# EAGLE design v1.0 (EAGLE 9.6.2)
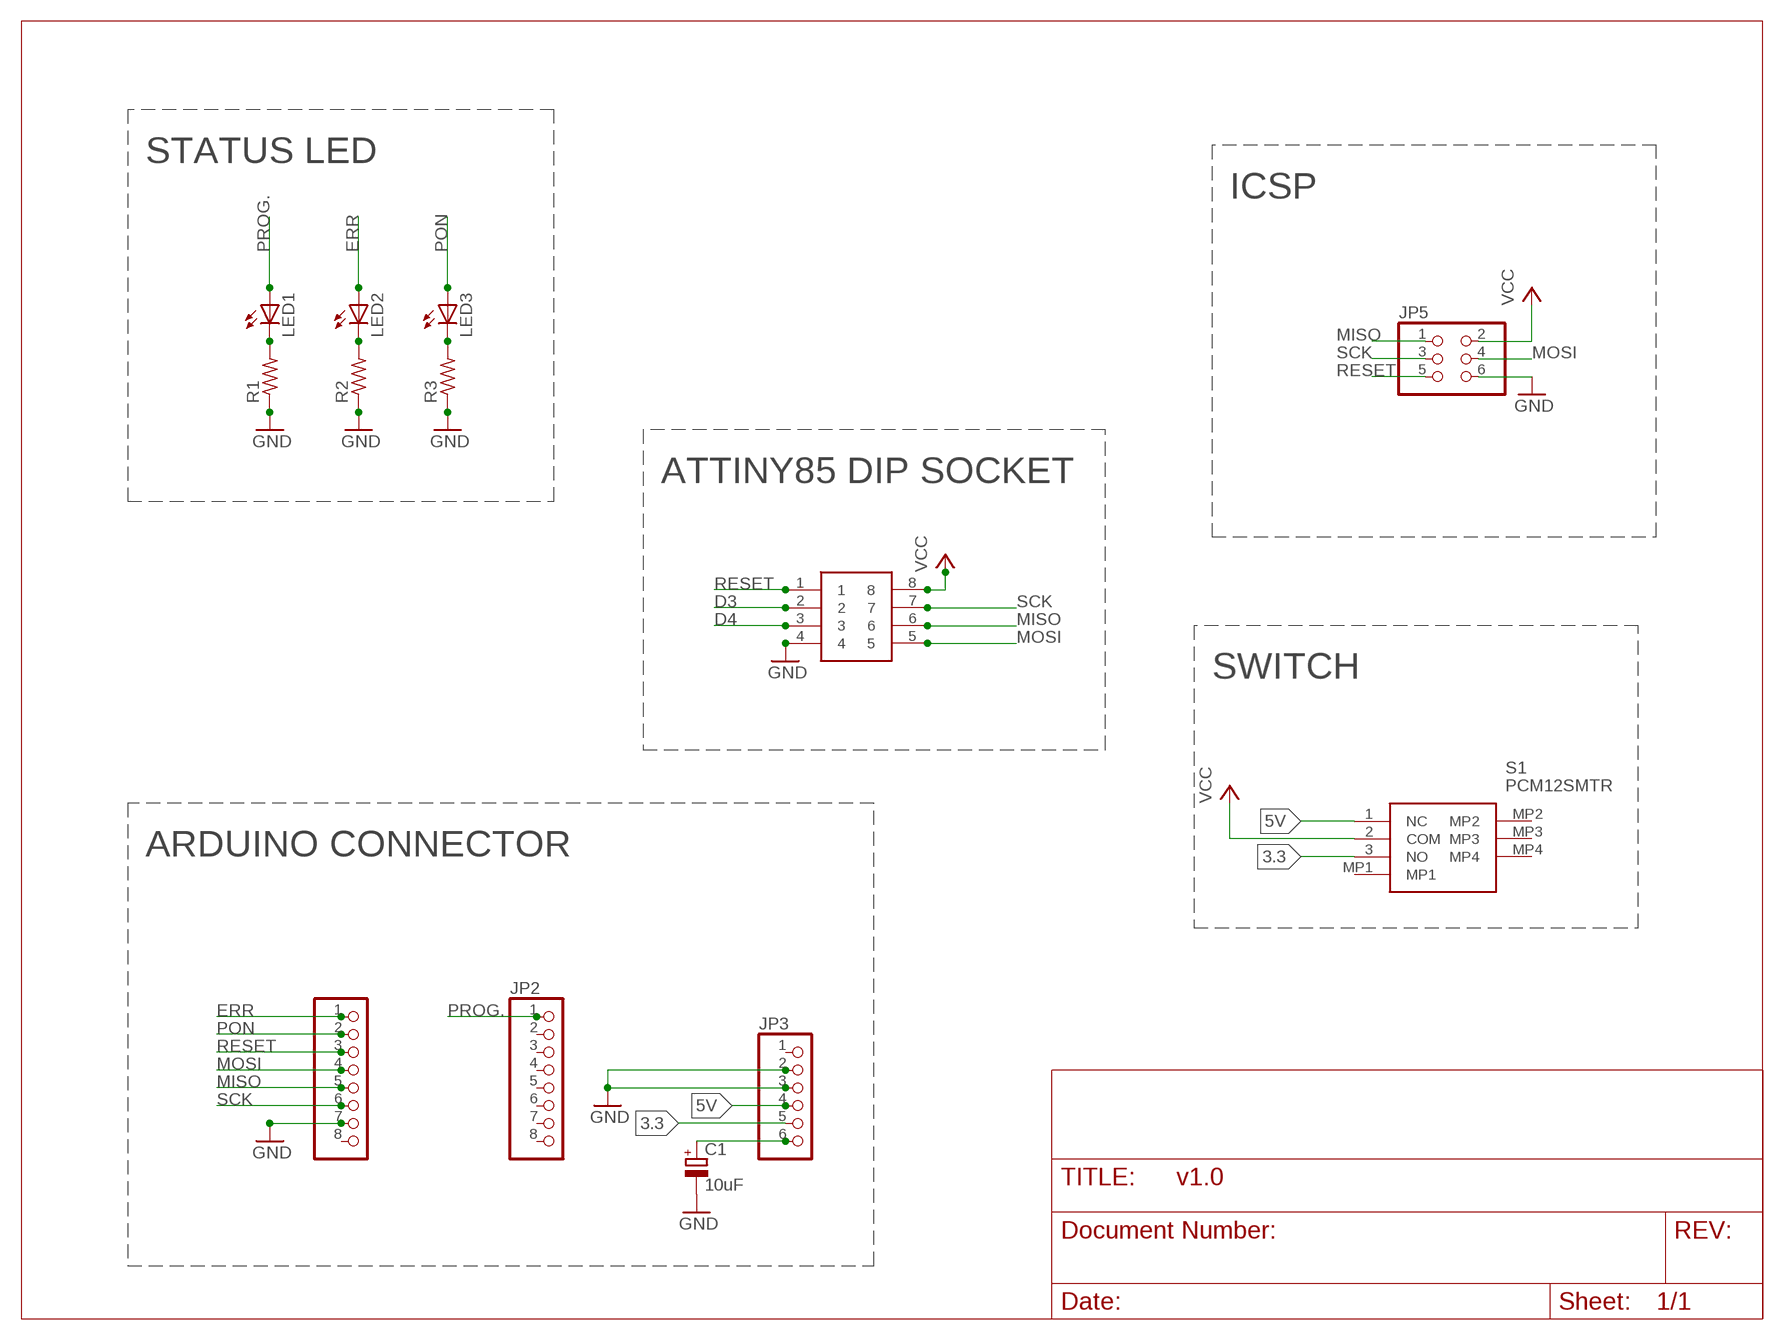
[diagram p0: schematic, sheet 1]

## Parts
C1  10uF  CPOL-EUE2-5  [E2-5]
IC1  1-2199298-2  [DIPS762W70P254L1016H510Q8N]
JP2  PINHD-1X8  [1X08]
JP3  PINHD-1X6  [1X06]
JP4  PINHD-1X8  [1X08]
JP5  PINHD-2X3  [2X03]
LED1  LED3MM  [LED3MM]
LED2  LED3MM  [LED3MM]
LED3  LED3MM  [LED3MM]
R1  R-US_0207/10  [0207/10]
R2  R-US_0207/10  [0207/10]
R3  R-US_0207/10  [0207/10]
S1  PCM12SMTR  [PCM12SMTR]

## Nets
3.3: JP3.5 S1.3(NO)
5V: JP3.4 S1.1(NC)
D3: IC1.2
D4: IC1.3
ERR: JP4.1 LED2.A
GND: C1.- IC1.4 JP3.2 JP3.3 JP4.7 JP5.6 R1.1 R2.1 R3.1
MISO: IC1.6 JP4.5 JP5.1
MOSI: IC1.5 JP4.4 JP5.4
N$1: C1.+ JP3.6
N$2: LED1.K(C) R1.2
N$3: LED2.K(C) R2.2
N$4: LED3.K(C) R3.2
PON: JP4.2 LED3.A
PROG.: JP2.1 LED1.A
RESET: IC1.1 JP4.3 JP5.5
SCK: IC1.7 JP4.6 JP5.3
VCC: IC1.8 JP5.2 S1.2(COM)
Unconnected: JP2.2 JP2.3 JP2.4 JP2.5 JP2.6 JP2.7 JP2.8 JP3.1 JP4.8 S1.MP1 S1.MP2 S1.MP3 S1.MP4

## Notes on the sheet
- STATUS LED
- ICSP
- ATTINY85 DIP SOCKET
- SWITCH
- ARDUINO CONNECTOR

## Library data of the parts
C1 = rcl:CPOL-EU: POLARIZED CAPACITOR, European symbol; SPICEPREFIX: C
IC1 = 1-2199298-2:1-2199298-2: TE CONNECTIVITY - 1-2199298-2 - IC SOCKET, DIP, 8POS, TH Source: Datasheet <https://componentsearchengine.com/Datasheets/2/1-2199298-2.pdf>; DESCRIPTION: TE CONNECTIVITY - 1-2199298-2 - IC SOCKET, DIP, 8POS, TH; HEIGHT: 5.1mm; MANUFACTURER_NAME: TE Connectivity; MANUFACTURER_PART_NUMBER: 1-2199298-2; MOUSER_PART_NUMBER: 571-1-2199298-2; MOUSER_PRICE-STOCK: https://www.mouser.co.uk/ProductDetail/TE-Connectivity/1-2199298-2?qs=fK8dlpkaUMtEKa4wabwOXQ%3D%3D
JP2 JP4 = pinhead:PINHD-1X8: PIN HEADER
JP3 = pinhead:PINHD-1X6: PIN HEADER
JP5 = pinhead:PINHD-2X3: PIN HEADER
LED1-LED3 = adafruit:LED: LED OSRAM: - CHIPLED LG R971, LG N971, LY N971, LG Q971, LY Q971, LO R971, LY R971 LH N974, LH R974 LS Q976, LO Q976, LY Q976 LO Q996 - Hyper CHIPLED LW Q18S LB Q993, LB Q99A, LB R99A - SideLED LS A670, LO A670, LY A670, LG A670, LP A670 LB A673, LV A673, LT A673, LW A673 LH A674 LY A675 LS A676, LA A676, LO A676, LY A676, LW A676 LS A679, LY A679, LG A679 - Hyper Micro SIDELED® LS Y876, LA Y876, LO Y876, LY Y876 LT Y87S - SmartLED LW L88C, LW L88S LB L89C, LB L89S, LG L890 LS L89K, LO L89K, LY L89K LS L896, LA L896, LO L896, LY L896 - TOPLED LS T670, LO T670, LY T670, LG T670, LP T670 LSG T670, LSP T670, LSY T670, LOP T670, LYG T670 LG T671, LOG T671, LSG T671 LB T673, LV T673, LT T673, LW T673 LH T674 LS T676, LA T676, LO T676, LY T676, LB T676, LH T676, LSB T676, LW T676 LB T67C, LV T67C, LT T67C, LS T67K, LO T67K, LY T67K, LW E67C LS E67B, LA E67B, LO E67B, LY E67B, LB E67C, LV E67C, LT E67C LW T67C LS T679, LY T679, LG T679 LS T770, LO T770, LY T770, LG T770, LP T770 LB T773, LV T773, LT T773, LW T773 LH T774 LS E675, LA E675, LY E675, LS T675 LS T776, LA T776, LO T776, LY T776, LB T776 LHGB T686 LT T68C, LB T68C - Hyper Mini TOPLED® LB M676 - Mini TOPLED Santana® LG M470 LS M47K, LO M47K, LY M47K Source: http://www.osram.convergy.de/
R1-R3 = adafruit:R-US_: RESISTOR, American symbol
S1 = PCM12SMTR:PCM12SMTR: Slide Switches 0.3A SPDT ON-ON Source: Datasheet; DESCRIPTION: Slide Switches 0.3A SPDT ON-ON; HEIGHT: 1.4mm; MANUFACTURER_NAME: C & K COMPONENTS; MANUFACTURER_PART_NUMBER: PCM12SMTR; MOUSER_PART_NUMBER: 611-PCM12SMTR; MOUSER_PRICE-STOCK: https://www.mouser.co.uk/ProductDetail/CK/PCM12SMTR?qs=mfFuHy8STfL3qrPSfCHA7w%3D%3D

## Board
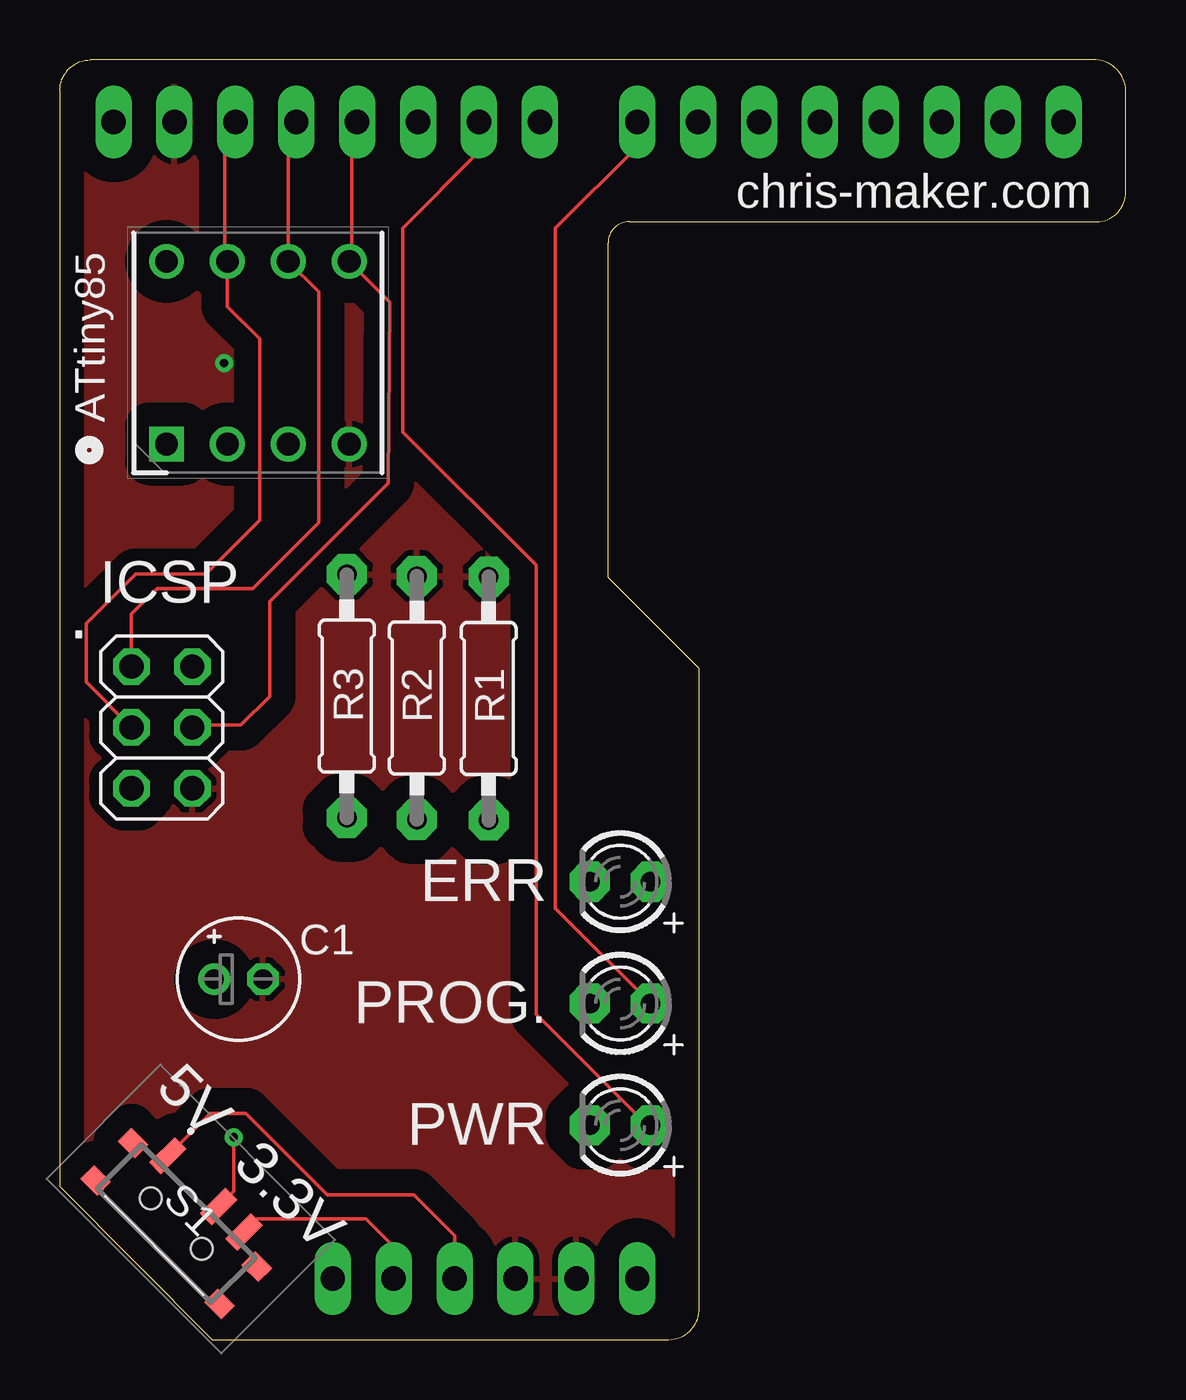
[diagram p1: board, top side]
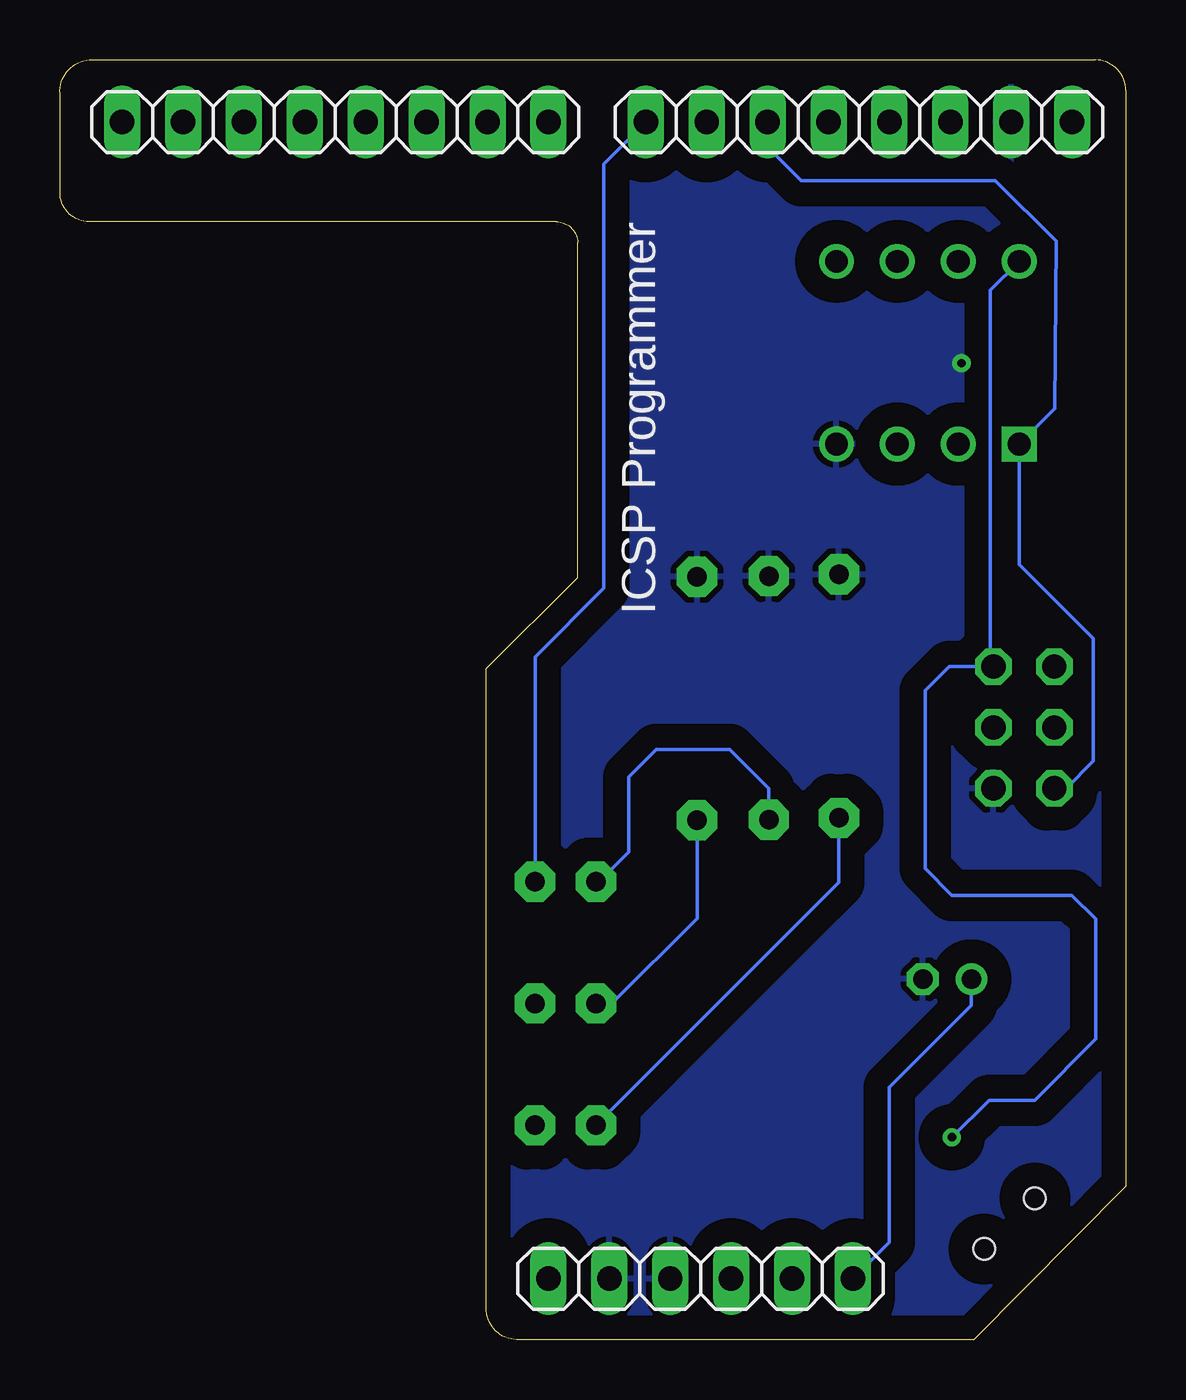
[diagram p2: board, bottom side, seen from below]

Size 44.45 x 53.39 mm. Coordinates in mm from the lower left corner, seen from the top.
Outline: 6.35,0 25.4,0 arc90 26.67,1.32 26.67,27.99 22.86,31.8 22.86,45.77 arc-90 23.75,46.63 43.23,46.63 arc90 44.45,47.88 44.45,51.99 arc90 43.23,53.39 1.27,53.39 arc90 0,52.12 0,6.4 6.35,0
Copper layers (1*16): Top 0.035mm / dielectric 1.5mm / Bottom 0.035mm
Design rules "default": minimum track width 6mil, minimum drill 0.35mm, track to track 6mil, track to pad 6mil, pad to pad 6mil, via to via 6mil, smd to smd 6mil, copper to edge 40mil, drill to drill 6mil, minimum pad ring 10mil, minimum via ring 8mil, stop-mask expansion 4mil, vias tented up to drill 0mil, thermal gap 10mil

### Footprints (pad centres in the part's own frame; a part is rotated, then mirrored left to right if it is on the bottom)
E2-5 = drill 0.813 pad 1.27: + -1.016,0 | drill 0.813 pad 1.27 octagon: - 1.016,0
DIPS762W70P254L1016H510Q8N = drill 0.95 pad 1.425 square: 1 0,0 | drill 0.95 pad 1.425: 2 0,-2.54; 3 0,-5.08; 4 0,-7.62; 5 7.62,-7.62; 6 7.62,-5.08; 7 7.62,-2.54; 8 7.62,0
1X08 = drill 1.016 long: 1 -8.89,0; 2 -6.35,0; 3 -3.81,0; 4 -1.27,0; 5 1.27,0; 6 3.81,0; 7 6.35,0; 8 8.89,0
1X06 = drill 1.016 long: 1 -6.35,0; 2 -3.81,0; 3 -1.27,0; 4 1.27,0; 5 3.81,0; 6 6.35,0
2X03 = drill 1.016 octagon: 1 -2.54,-1.27; 2 -2.54,1.27; 3 0,-1.27; 4 0,1.27; 5 2.54,-1.27; 6 2.54,1.27
LED3MM = drill 0.813 pad 1.676 octagon: A -1.27,0; K 1.27,0
0207/10 = drill 0.813 pad 1.676 octagon: 1 -5.08,0; 2 5.08,0
PCM12SMTR = smd 0.7 x 1.5: 1 -2.25,1.75; 2 0.75,1.75; 3 2.25,1.75 | smd 1 x 0.8: MP1 -3.65,1.1; MP2 -3.65,-1.1; MP3 3.65,-1.1; MP4 3.65,1.1 | hole 0.9: -1.5,0; 1.5,0

### Placement (x,y rotation side)
C1  7.45,15.04 0 top
IC1  4.45,37.36 90 top
JP2  32.97,50.8 180 bottom
JP3  17.73,2.54 0 bottom
JP4  11.13,50.8 0 bottom
JP5  4.25,25.54 270 top
LED1  23.37,14.02 180 top
LED2  23.37,19.1 180 top
LED3  23.37,8.94 180 top
R1  17.88,26.75 270 top
R2  14.88,26.77 270 top
R3  11.96,26.85 270 top
S1  4.85,4.84 315 top

### Tracks (layer width: path | path; a pad name or v marks a point on that pad's centre or on a via)
3.3
  Top 0.152: S1.3 8.23,5.04 12.75,5.04 13.92,3.87 JP3.5
5V
  Top 0.152: S1.1 6.27,9.44 7.75,9.44 11.15,6.04 14.75,6.04 16.46,4.33 JP3.4
ERR
  Bottom 0.152: JP4.1 21.77,49.05 21.77,31.35 24.64,28.48 LED2.A
GND  (via drill 0.35)
  Bottom 0.152: R3.1 12.04,31.93 12.06,31.95
  other vias: 6.85,40.74
  pour Bottom (isolate 1): -1.75,54.54 -1.75,6.54 6.25,-1.46 28.25,-1.46 28.25,28.54 24.25,32.54 24.25,44.54 46.25,44.54 46.25,54.54
  pour Top (isolate 1): -2.75,55.54 -2.75,5.54 5.25,-2.46 29.25,-2.46 29.25,29.54 25.25,33.54 25.25,43.54 47.25,43.54 47.25,55.54
MISO
  Top 0.152: JP4.5 9.52,50.47 IC1.6 10.8,43.71 10.8,35.14 10.8,34.72 10.8,34.09 8.05,31.34 4.05,31.34 2.98,30.27 JP5.1
MOSI
  Top 0.152: JP4.4 12.17,50.57 12.17,45.08 IC1.5 13.76,43.29 13.69,35.74 11.37,33.42 9.88,31.93 8.75,30.8 8.75,26.84 7.55,25.64 5.62,25.64 JP5.4
N$1
  Bottom 0.152: JP3.6 9.86,4.06 9.86,10.51 6.43,13.94 C1.+
N$2
  Bottom 0.152: R1.2 17.88,17.58 21.44,14.02 LED1.K
N$3
  Bottom 0.152: R2.2 14.88,22.99 16.51,24.61 19.58,24.61 20.73,23.47 20.73,20.35 21.97,19.1 LED2.K
N$4
  Bottom 0.152: R3.2 11.96,19.08 LED3.K
PON
  Top 0.152: JP4.2 17.48,49.56 14.3,46.38 14.3,37.87 19.86,32.31 19.86,13.56 24.49,8.94 LED3.A
PROG.
  Top 0.152: LED1.A 20.67,17.99 20.67,46.37 24.08,49.78 JP2.1
RESET
  Bottom 0.152: JP4.3 14.95,49.78 13.54,48.36 5.44,48.36 2.9,45.83 2.96,38.85 IC1.1 4.45,32.34 1.35,29.24 1.35,24.14 2.49,23 JP5.5
SCK
  Top 0.152: JP4.6 6.88,50.37 6.88,45.08 IC1.7 6.98,43.1 8.33,41.76 8.33,34.19 6.09,31.94 3.15,31.94 1.09,29.88 1.09,27.43 JP5.3
VCC  (via drill 0.35)
  Top 0.152: S1.2 7.25,6.18 v7.25,8.44
  Bottom 0.152: v7.25,8.44 5.7,9.99 3.8,9.99 1.25,12.54 1.25,17.54 2.25,18.54 7.25,18.54 8.36,19.65 8.36,27.09 7.36,28.08 JP5.2 5.65,28.21 5.65,43.78 IC1.8

### Text on the board
tPlace: chris-maker.com | ATtiny85 | PROG. | PWR
bPlace: ICSP Programmer
tNames: ICSP | . | ERR | 5V | 3.3V